# EasyEDA schematic GSE Analog Remote BOTTOM Schematic v1 EasyEDA.json
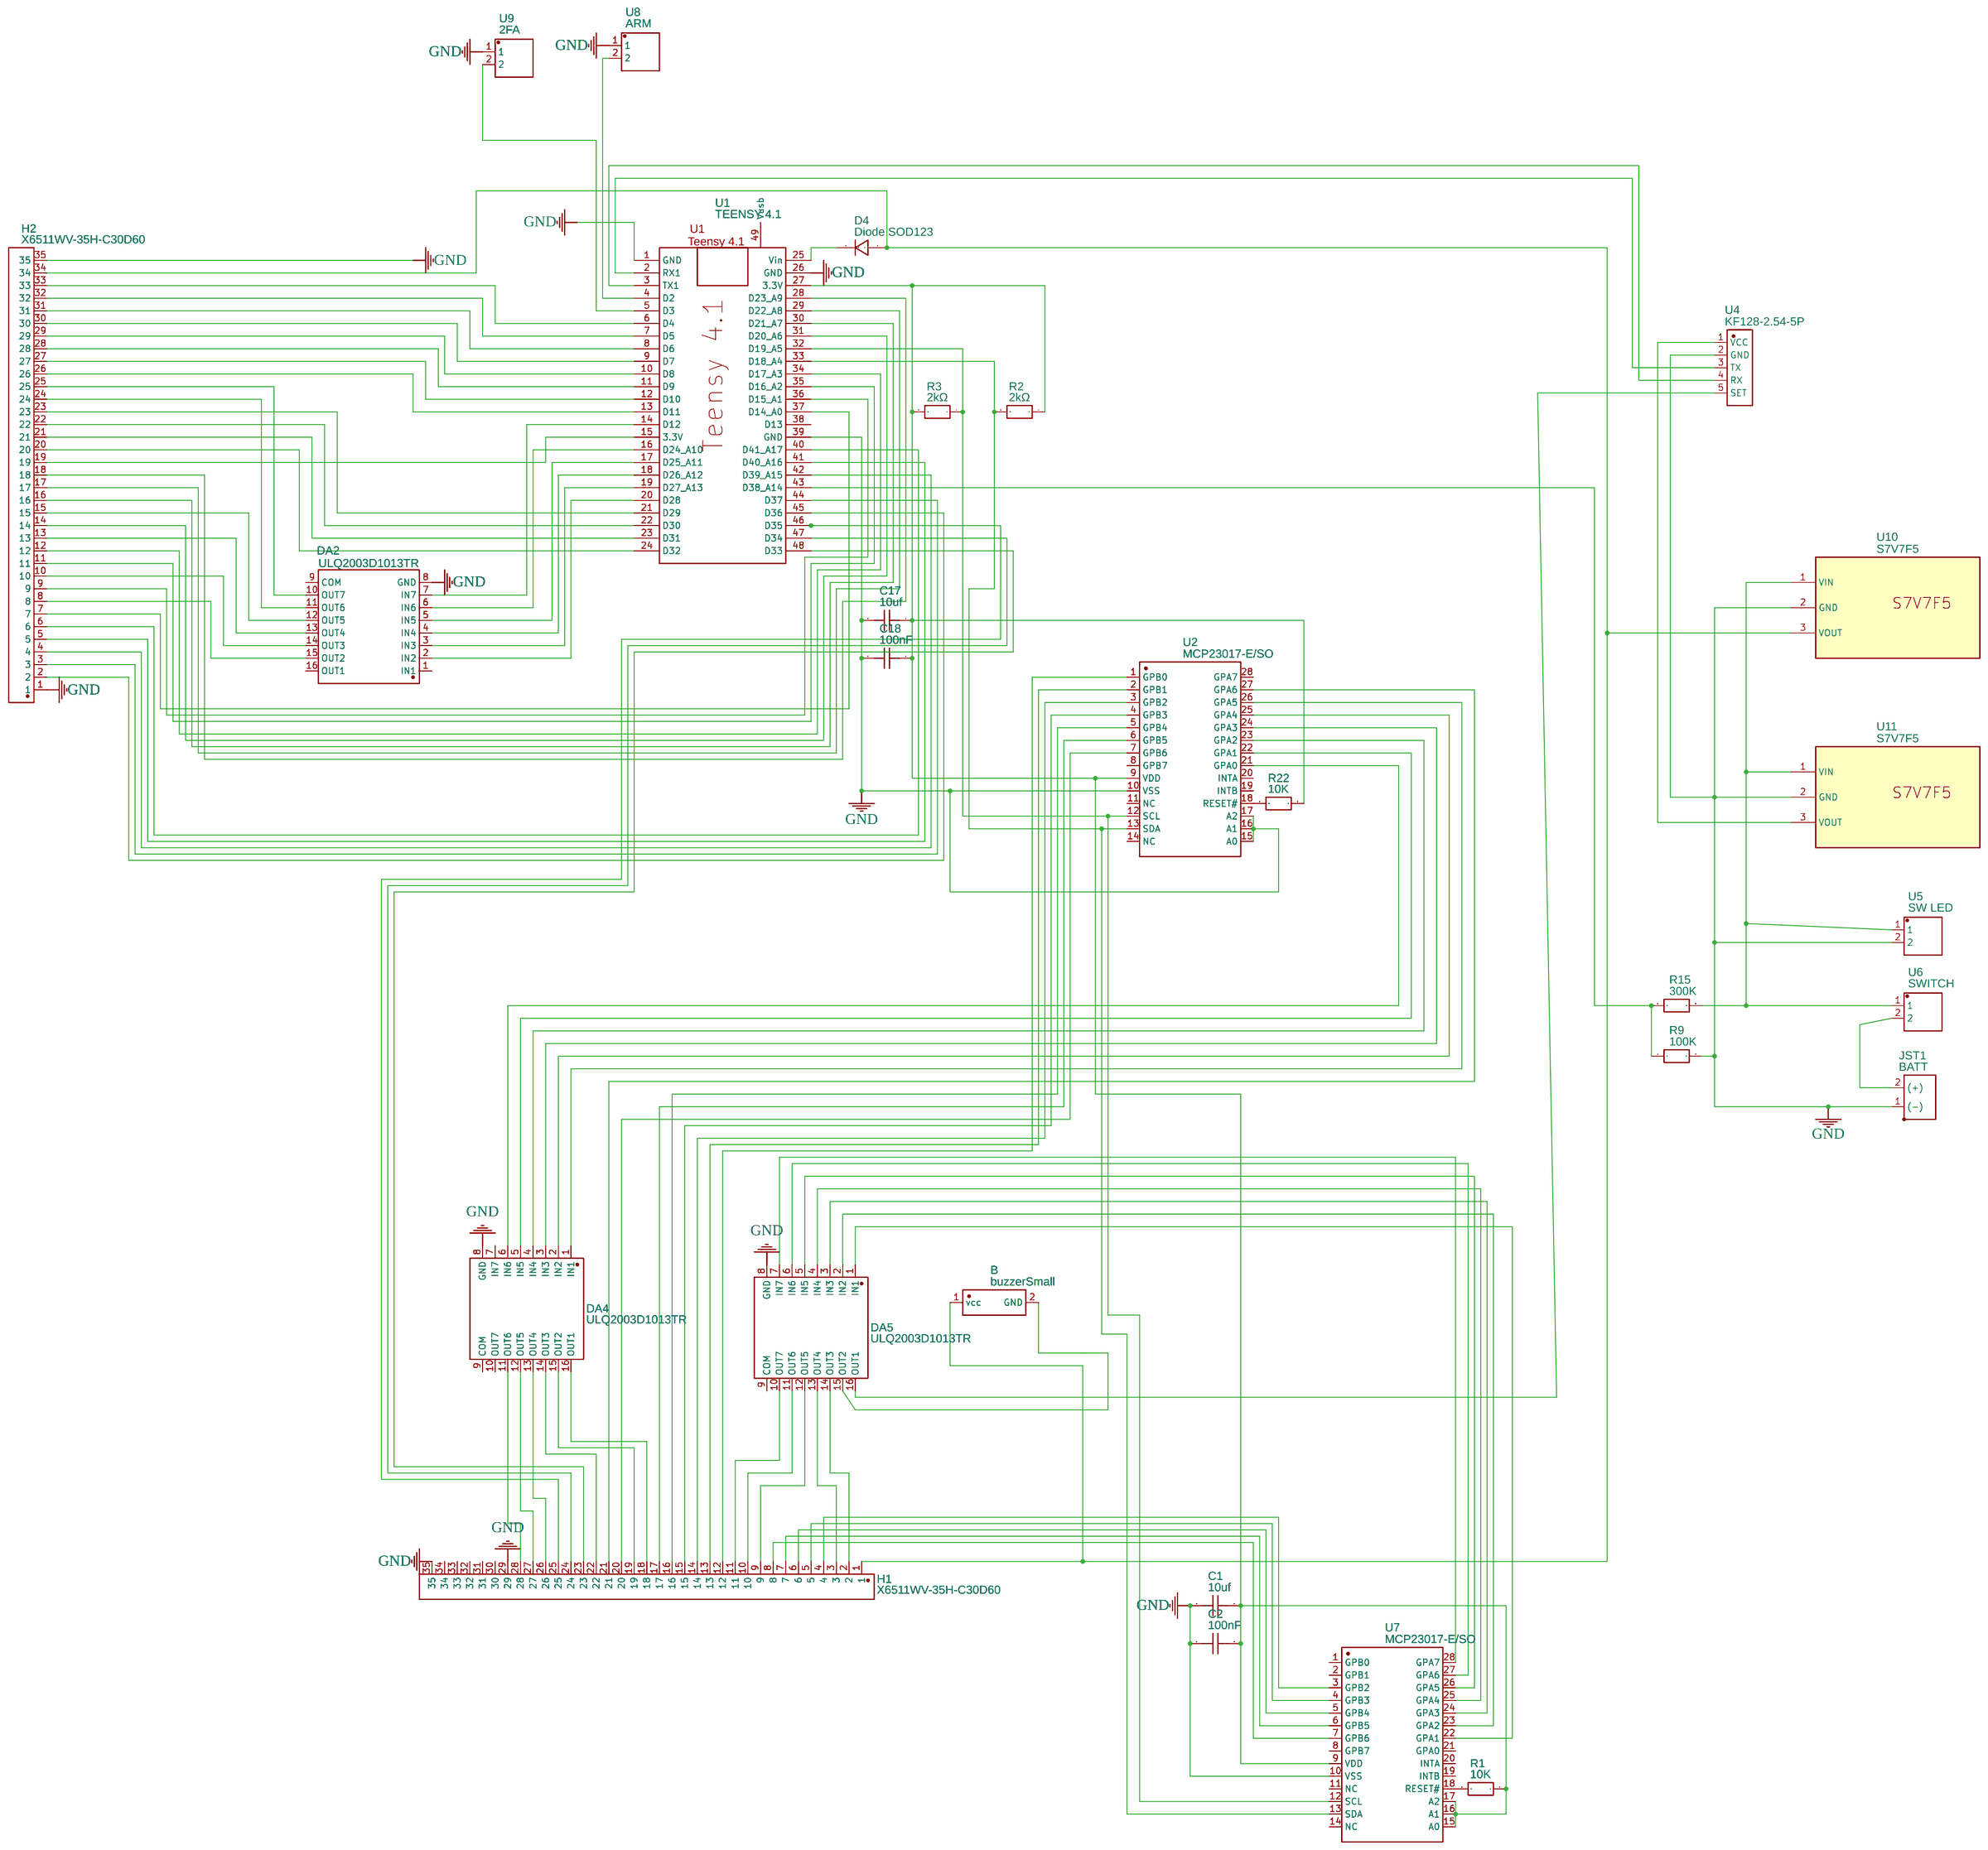
[diagram p0: schematic sheet]

## Parts
B  buzzerSmall  [BUZZERSMALL]
C1  10uf  [C0402]
C2  100nF  [C0402]
C17  10uf  [C0402]
C18  100nF  [C0402]
D4  Diode SOD123  [SOD-123W_L2.9-W2.1-LS4.4-RD]
DA2  ULQ2003D1013TR  [SOIC-16_L9.9-W3.9-P1.27-LS6.0-BL]
DA4  ULQ2003D1013TR  [SOIC-16_L9.9-W3.9-P1.27-LS6.0-BL]
DA5  ULQ2003D1013TR  [SOIC-16_L9.9-W3.9-P1.27-LS6.0-BL]
H1  X6511WV-35H-C30D60  [HDR-TH_35P-P2.54-V-M]
H2  X6511WV-35H-C30D60  [HDR-TH_35P-P2.54-V-M]
JST1  BATT  [JSTX2F]
R1  10K  [R0805]
R2  2kΩ  [R0805]
R3  2kΩ  [R0805]
R9  100K  [R0805]
R15  300K  [R0805]
R22  10K  [R0805]
U1  TEENSY 4.1  [TEENSY 4.1]
U2  MCP23017-E/SO  [SOIC-28_L18.0-W7.5-P1.27-LS10.3-BL]
U4  KF128-2.54-5P  [CONN-TH_5P-P2.54_KF128-2.54-5P]
U5  SW LED  [CONN-TH_S2B-PH-K-S-LF-SN]
U6  SWITCH  [CONN-TH_S2B-PH-K-S-LF-SN]
U7  MCP23017-E/SO  [SOIC-28_L18.0-W7.5-P1.27-LS10.3-BL]
U8  ARM  [CONN-TH_S2B-PH-K-S-LF-SN]
U9  2FA  [CONN-TH_S2B-PH-K-S-LF-SN]
U10  S7V7F5  [S7V7F5]
U11  S7V7F5  [S7V7F5]

## Library data of the parts
B = buzzerSmall: Contributor: mbrinker
C1 C2 C17 C18 = CC0402KRX7R6BB104: Supplier: LCSC; Supplier Part: C309458; Manufacturer: YAGEO; Contributor: LCSC; SMT Type: Extend; JLCPCB SMD: Yes; LCSC Assembly: Yes; Paste Type: expand
D4 = S15MLW RVG: Supplier: LCSC; Supplier Part: C483951; Manufacturer: Taiwan Semiconductor(Taiwan Semicon); Contributor: LCSC; JLCPCB Part Class: Extended Part
DA2 DA4 DA5 = ULQ2003D1013TR: Supplier: LCSC; Manufacturer: STMicroelectronics; Contributor: LCSC; Supplier Part: C155642; JLCPCB Part Class: Extended Part
H1 H2 = X6511WV-35H-C30D60: Contributor: LCSC; Supplier: LCSC; Supplier Part: C2883694; Manufacturer: XKB Connectivity(中国星坤)
JST1 = JST2X: Contributor: mbrinker
R1-R3 R22 = ERA6AEB202V: Supplier: LCSC; Supplier Part: C417117; Manufacturer: PANASONIC; Contributor: LCSC
R9 R15 = ERJP06J221V: Supplier: LCSC; Supplier Part: C417010; Manufacturer: PANASONIC; Contributor: LCSC
U1 = TEENSY 4.1: Contributor: cagoldwater
U2 U7 = MCP23017-E/SO: Contributor: LCSC; Supplier: LCSC; Manufacturer: MICROCHIP(美国微芯); Supplier Part: C47023; JLCPCB Part Class: Extended Part
U4 = KF128-2.54-5P: Contributor: LCSC; Supplier: LCSC; Supplier Part: C474923; Manufacturer: KEFA(科发); JLCPCB Part Class: Extended Part; link: https://lcsc.com/eda_search?q=C474923&%26type=1&ref=editor
U5 U6 U8 U9 = S2B-PH-K-S(LF)(SN): Contributor: LCSC; Supplier: LCSC; Supplier Part: C173752; Manufacturer: JST; JLCPCB Part Class: Extended Part; link: https://lcsc.com/eda_search?q=C173752&%26type=1&ref=editor
U10 U11 = S7V7F5: Contributor: winter2015; sourceId: YsmgyP7pj

## Nets
GND: C1.2 C2.2 C17.2 C18.2 DA2.8(GND) DA4.8(GND) DA5.8(GND) H1.29 H1.35 H2.1 H2.35 JST1.1((-)) R9.2 U1.1(GND) U1.26(GND) U1.39(GND) U2.10(VSS) U2.15(A0) U2.16(A1) U2.17(A2) U4.2(GND) U5.2 U7.10(VSS) U8.1 U9.1 U10.2(GND) U11.2(GND)
Net-(B-1): B.1(vcc) D4.2 H1.1 H2.34 U10.3(VOUT)
Net-(B-2): B.2(GND) DA5.15(OUT2)
Net-(C1-1): C1.1 C2.1 C17.1 C18.1 R1.1 R2.1 R3.2 R22.1 U1.27(3.3V) U2.9(VDD) U7.9(VDD) U7.15(A0) U7.16(A1) U7.17(A2)
Net-(D4-1): D4.1 U1.25(Vin)
Net-(DA2-2): DA2.2(IN2) U1.20(D28)
Net-(DA2-3): DA2.3(IN3) U1.19(D27 A13)
Net-(DA2-4): DA2.4(IN4) U1.18(D26 A12)
Net-(DA2-5): DA2.5(IN5) U1.17(D25 A11)
Net-(DA2-6): DA2.6(IN6) U1.16(D24 A10)
Net-(DA2-7): DA2.7(IN7) U1.14(D12)
Net-(DA2-10): DA2.10(OUT7) H2.25
Net-(DA2-11): DA2.11(OUT6) H2.24
Net-(DA2-12): DA2.12(OUT5) H2.15
Net-(DA2-13): DA2.13(OUT4) H2.13
Net-(DA2-14): DA2.14(OUT3) H2.10
Net-(DA2-15): DA2.15(OUT2) H2.8
Net-(DA4-1): DA4.1(IN1) U2.26(GPA5)
Net-(DA4-2): DA4.2(IN2) U2.25(GPA4)
Net-(DA4-3): DA4.3(IN3) U2.24(GPA3)
Net-(DA4-4): DA4.4(IN4) U2.23(GPA2)
Net-(DA4-5): DA4.5(IN5) U2.22(GPA1)
Net-(DA4-6): DA4.6(IN6) U2.21(GPA0)
Net-(DA4-11): DA4.11(OUT6) H1.28
Net-(DA4-12): DA4.12(OUT5) H1.27
Net-(DA4-13): DA4.13(OUT4) H1.26
Net-(DA4-14): DA4.14(OUT3) H1.22
Net-(DA4-15): DA4.15(OUT2) H1.19
Net-(DA4-16): DA4.16(OUT1) H1.18
Net-(DA5-1): DA5.1(IN1) U7.22(GPA1)
Net-(DA5-2): DA5.2(IN2) U7.23(GPA2)
Net-(DA5-3): DA5.3(IN3) U7.24(GPA3)
Net-(DA5-4): DA5.4(IN4) U7.25(GPA4)
Net-(DA5-5): DA5.5(IN5) U7.26(GPA5)
Net-(DA5-6): DA5.6(IN6) U7.27(GPA6)
Net-(DA5-7): DA5.7(IN7) U7.28(GPA7)
Net-(DA5-10): DA5.10(OUT7) H1.11
Net-(DA5-11): DA5.11(OUT6) H1.10
Net-(DA5-12): DA5.12(OUT5) H1.9
Net-(DA5-13): DA5.13(OUT4) H1.3
Net-(DA5-14): DA5.14(OUT3) H1.2
Net-(DA5-16): DA5.16(OUT1) U4.5(SET)
Net-(H1-4): H1.4 U7.3(GPB2)
Net-(H1-5): H1.5 U7.4(GPB3)
Net-(H1-6): H1.6 U7.5(GPB4)
Net-(H1-7): H1.7 U7.6(GPB5)
Net-(H1-8): H1.8 U7.7(GPB6)
Net-(H1-12): H1.12 U2.1(GPB0)
Net-(H1-13): H1.13 U2.2(GPB1)
Net-(H1-14): H1.14 U2.3(GPB2)
Net-(H1-15): H1.15 U2.4(GPB3)
Net-(H1-16): H1.16 U2.5(GPB4)
Net-(H1-17): H1.17 U2.6(GPB5)
Net-(H1-20): H1.20 U2.7(GPB6)
Net-(H1-21): H1.21 U2.27(GPA6)
Net-(H1-23): H1.23 U1.48(D33)
Net-(H1-24): H1.24 U1.47(D34)
Net-(H1-25): H1.25 U1.46(D35)
Net-(H2-2): H2.2 U1.45(D36)
Net-(H2-3): H2.3 U1.44(D37)
Net-(H2-4): H2.4 U1.42(D39 A15)
Net-(H2-5): H2.5 U1.41(D40 A16)
Net-(H2-6): H2.6 U1.40(D41 A17)
Net-(H2-7): H2.7 U1.37(D14 A0)
Net-(H2-9): H2.9 U1.36(D15 A1)
Net-(H2-11): H2.11 U1.35(D16 A2)
Net-(H2-12): H2.12 U1.34(D17 A3)
Net-(H2-14): H2.14 U1.31(D20 A6)
Net-(H2-16): H2.16 U1.30(D21 A7)
Net-(H2-17): H2.17 U1.29(D22 A8)
Net-(H2-18): H2.18 U1.28(D23 A9)
Net-(H2-19): H2.19 U1.15(3.3V)
Net-(H2-20): H2.20 U1.24(D32)
Net-(H2-21): H2.21 U1.23(D31)
Net-(H2-22): H2.22 U1.22(D30)
Net-(H2-23): H2.23 U1.21(D29)
Net-(H2-26): H2.26 U1.13(D11)
Net-(H2-27): H2.27 U1.12(D10)
Net-(H2-28): H2.28 U1.11(D9)
Net-(H2-29): H2.29 U1.10(D8)
Net-(H2-30): H2.30 U1.9(D7)
Net-(H2-31): H2.31 U1.8(D6)
Net-(H2-32): H2.32 U1.7(D5)
Net-(H2-33): H2.33 U1.6(D4)
Net-(JST1-2): JST1.2((+)) U6.2
Net-(R1-2): R1.2 U7.18(RESET#)
Net-(R2-2): R2.2 U1.33(D18 A4) U2.13(SDA) U7.13(SDA)
Net-(R3-1): R3.1 U1.32(D19 A5) U2.12(SCL) U7.12(SCL)
Net-(R9-1): R9.1 R15.1 U1.43(D38 A14)
Net-(R15-2): R15.2 U5.1 U6.1 U10.1(VIN) U11.1(VIN)
Net-(R22-2): R22.2 U2.18(RESET#)
Net-(U1-2): U1.2(RX1) U4.3(TX)
Net-(U1-3): U1.3(TX1) U4.4(RX)
Net-(U1-4): U1.4(D2) U8.2
Net-(U1-5): U1.5(D3) U9.2
Net-(U4-1): U4.1(VCC) U11.3(VOUT)

Not connected (* = marked no-connect by the designer): DA2 1(IN1) 9(COM) 16(OUT1); DA4 7(IN7) 9(COM) 10(OUT7); DA5 9(COM); H1 30 31 32 33 34; U1 38(D13) 49(Vusb); U2 8(GPB7) 11(NC) 14(NC) 19(INTB) 20(INTA) 28(GPA7); U7 1(GPB0) 2(GPB1) 8(GPB7) 11(NC) 14(NC) 19(INTB) 20(INTA) 21(GPA0)
